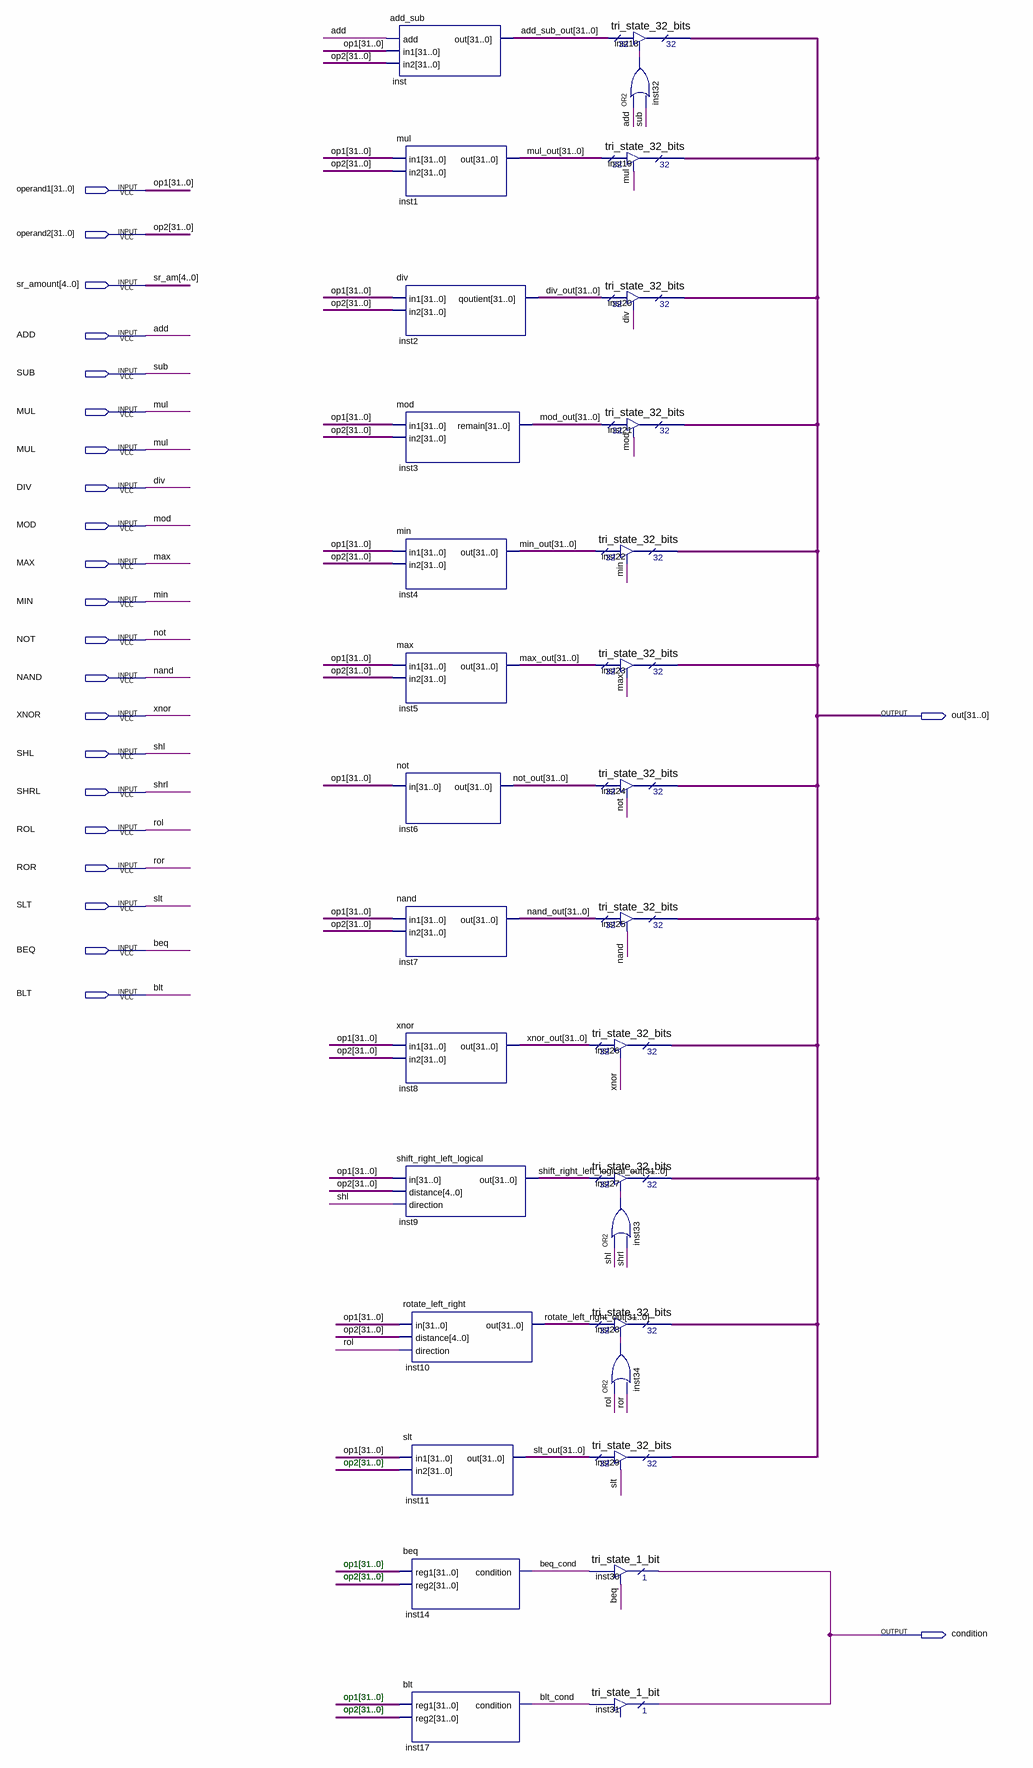
[diagram p0: schematic sheet]
// Quartus schematic ALU.bdf as structural Verilog: 31 symbols, 23 pins
module ALU (
  input  [31:0] operand1,
  input  [31:0] operand2,
  input  [4:0] sr_amount,
  input  ADD,
  input  SUB,
  input  MUL,
  input  DIV,
  input  MOD,
  input  MAX,
  input  MIN,
  input  NOT,
  input  NAND,
  input  XNOR,
  input  SHL,
  input  SHRL,
  input  ROL,
  input  ROR,
  input  SLT,
  input  BEQ,
  input  BLT,
  output [31:0] out,
  output condition
);

  wire beq_cond, blt_cond, inst32_out, inst33_out, inst34_out;
  wire [31:0] add_sub_out, div_out, max_out, min_out, mod_out, mul_out, nand_out, not_out,
       rotate_left_right_out, shift_right_left_logical_out, slt_out, xnor_out;

  add_sub inst (.add(ADD), .in1(operand1), .in2(operand2), .out(add_sub_out));
  mul inst1 (.in1(operand1), .in2(operand2), .out(mul_out));
  div inst2 (.in1(operand1), .in2(operand2), .qoutient(div_out));
  mod inst3 (.in1(operand1), .in2(operand2), .remain(mod_out));
  min inst4 (.in1(operand1), .in2(operand2), .out(min_out));
  max inst5 (.in1(operand1), .in2(operand2), .out(max_out));
  \not  inst6 (.in(operand1), .out(not_out));
  \nand  inst7 (.in1(operand1), .in2(operand2), .out(nand_out));
  \xnor  inst8 (.in1(operand1), .in2(operand2), .out(xnor_out));
  shift_right_left_logical inst9 (
    .in(operand1), .distance(operand2), .direction(SHL), .out(shift_right_left_logical_out));
  rotate_left_right inst10 (.in(operand1), .distance(operand2), .direction(ROL), .out(rotate_left_right_out));
  slt inst11 (.in1(operand1), .in2(operand2), .out(slt_out));
  beq inst14 (.reg1(operand1), .reg2(operand2), .condition(beq_cond));
  blt inst17 (.reg1(operand1), .reg2(operand2), .condition(blt_cond));
  tri_state_32_bits inst26 (.enabledt(XNOR), .data(xnor_out), .tridata(out));
  tri_state_32_bits inst27 (.enabledt(inst33_out), .data(shift_right_left_logical_out), .tridata(out));
  tri_state_32_bits inst28 (.enabledt(inst34_out), .data(rotate_left_right_out), .tridata(out));
  tri_state_32_bits inst29 (.enabledt(SLT), .data(slt_out), .tridata(out));
  tri_state_1_bit inst30 (.enabledt(BEQ), .data(beq_cond), .tridata(condition));
  tri_state_1_bit inst31 (.data(blt_cond), .tridata(condition));  // open: enabledt
  tri_state_32_bits inst18 (.enabledt(inst32_out), .data(add_sub_out), .tridata(out));
  or inst32 (inst32_out, ADD, SUB);
  tri_state_32_bits inst19 (.enabledt(MUL), .data(mul_out), .tridata(out));
  tri_state_32_bits inst20 (.enabledt(DIV), .data(div_out), .tridata(out));
  tri_state_32_bits inst21 (.enabledt(MOD), .data(mod_out), .tridata(out));
  tri_state_32_bits inst22 (.enabledt(MIN), .data(min_out), .tridata(out));
  tri_state_32_bits inst23 (.enabledt(MAX), .data(max_out), .tridata(out));
  tri_state_32_bits inst24 (.enabledt(NOT), .data(not_out), .tridata(out));
  tri_state_32_bits inst25 (.enabledt(NAND), .data(nand_out), .tridata(out));
  or inst33 (inst33_out, SHL, SHRL);
  or inst34 (inst34_out, ROL, ROR);

  // Other names for the same wires on the sheet: op1[31:0] = operand1; op2[31:0] = operand2; sr_am[4:0] = sr_amount

  // Notes on the sheet:
  //   op2[31..0]
  //   op1[31..0]
  //   op2[31..0]
  //   op2[31..0]
  //   op1[31..0]
  //   op2[31..0]
  //   op2[31..0]
endmodule
